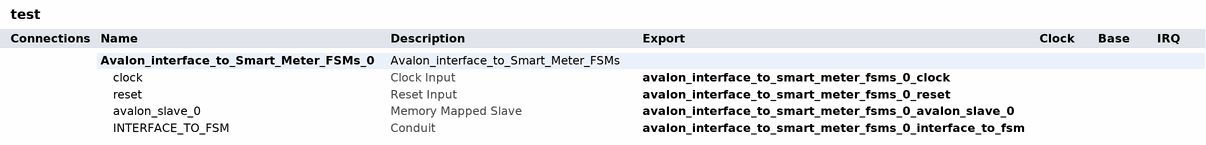
[diagram p0: system contents]
# Platform Designer (Qsys) system test, Cyclone V 5CSEBA6U23C7
# Parameters at their usual value, and those the tool derives, are not listed.
package require qsys
create_system test
set_project_property DEVICE_FAMILY {Cyclone V}
set_project_property DEVICE 5CSEBA6U23C7

add_instance Avalon_interface_to_Smart_Meter_FSMs_0 Avalon_interface_to_Smart_Meter_FSMs 1.0

# exported interfaces
add_interface avalon_interface_to_smart_meter_fsms_0_avalon_slave_0 avalon slave
set_interface_property avalon_interface_to_smart_meter_fsms_0_avalon_slave_0 EXPORT_OF Avalon_interface_to_Smart_Meter_FSMs_0.avalon_slave_0
add_interface avalon_interface_to_smart_meter_fsms_0_clock clock sink
set_interface_property avalon_interface_to_smart_meter_fsms_0_clock EXPORT_OF Avalon_interface_to_Smart_Meter_FSMs_0.clock
add_interface avalon_interface_to_smart_meter_fsms_0_interface_to_fsm conduit end
set_interface_property avalon_interface_to_smart_meter_fsms_0_interface_to_fsm EXPORT_OF Avalon_interface_to_Smart_Meter_FSMs_0.INTERFACE_TO_FSM
add_interface avalon_interface_to_smart_meter_fsms_0_reset reset sink
set_interface_property avalon_interface_to_smart_meter_fsms_0_reset EXPORT_OF Avalon_interface_to_Smart_Meter_FSMs_0.reset

set_interconnect_requirement {$system} qsys_mm.clockCrossingAdapter HANDSHAKE
set_interconnect_requirement {$system} qsys_mm.enableEccProtection FALSE
set_interconnect_requirement {$system} qsys_mm.insertDefaultSlave FALSE
set_interconnect_requirement {$system} qsys_mm.maxAdditionalLatency 1

save_system test.qsys
